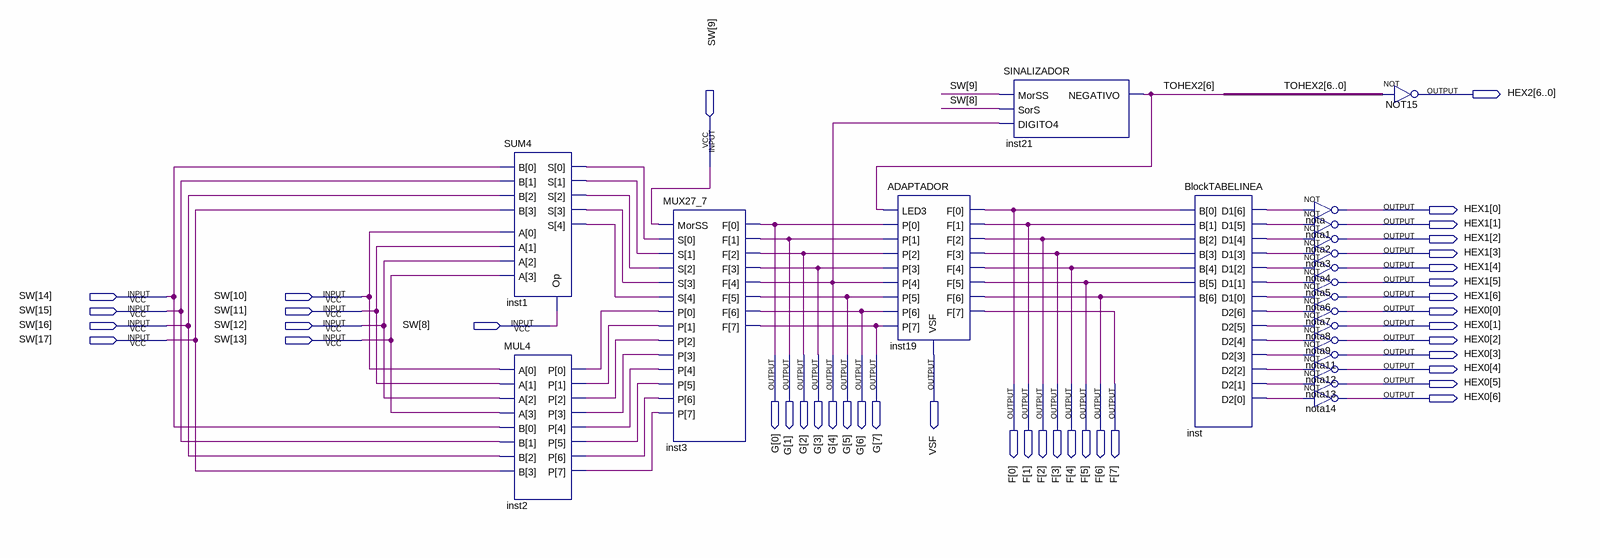
[diagram p0: schematic sheet]
// Quartus schematic ULA.bdf as structural Verilog: 21 symbols, 42 pins
module ULA (
  input  [17:8] SW,
  output [6:0] HEX2,
  output [6:0] HEX1,
  output [6:0] HEX0,
  output [7:0] G,
  output VSF,
  output [7:0] F
);

  wire inst1_s, inst1_s_2, inst1_s_3, inst1_s_4, inst1_s_5, inst2_p, inst2_p_2, inst2_p_3, inst2_p_4,
       inst2_p_5, inst2_p_6, inst2_p_7, inst2_p_8, inst_d1, inst_d1_2, inst_d1_3, inst_d1_4, inst_d1_5,
       inst_d1_6, inst_d1_7, inst_d2, inst_d2_2, inst_d2_3, inst_d2_4, inst_d2_5, inst_d2_6, inst_d2_7;
  wire [6:0] TOHEX2;

  SUM4 inst1 (.B(SW[17:14]), .Op(SW[8]), .A(SW[13:10]), .S({inst1_s_5, inst1_s_4, inst1_s_3, inst1_s_2, inst1_s}));
  MUL4 inst2 (
    .A(SW[13:10]), .B(SW[17:14]),
    .P({inst2_p_4, inst2_p_3, inst2_p_2, inst2_p_5, inst2_p_6, inst2_p, inst2_p_7, inst2_p_8}));
  MUX27_7 inst3 (
    .MorSS(SW[9]), .S({inst1_s_5, inst1_s_4, inst1_s_3, inst1_s_2, inst1_s}),
    .P({inst2_p_4, inst2_p_3, inst2_p_2, inst2_p_5, inst2_p_6, inst2_p, inst2_p_7, inst2_p_8}), .F(G));
  ADAPTADOR inst19 (.LED3(TOHEX2[6]), .P(G), .F(F), .VSF(VSF));
  SINALIZADOR inst21 (.MorSS(SW[9]), .SorS(SW[8]), .DIGITO4(G[4]), .NEGATIVO(TOHEX2[6]));
  BlockTABELINEA inst (
    .B(F[6:0]), .D1({inst_d1, inst_d1_2, inst_d1_3, inst_d1_4, inst_d1_5, inst_d1_6, inst_d1_7}),
    .D2({inst_d2, inst_d2_2, inst_d2_3, inst_d2_4, inst_d2_5, inst_d2_6, inst_d2_7}));
  not nota (HEX1[0], inst_d1);
  not nota1 (HEX1[1], inst_d1_2);
  not nota2 (HEX1[2], inst_d1_3);
  not nota3 (HEX1[3], inst_d1_4);
  not nota4 (HEX1[4], inst_d1_5);
  not nota5 (HEX1[5], inst_d1_6);
  not nota6 (HEX1[6], inst_d1_7);
  not nota7 (HEX0[0], inst_d2);
  not nota8 (HEX0[1], inst_d2_2);
  not nota9 (HEX0[2], inst_d2_3);
  not nota11 (HEX0[3], inst_d2_4);
  not nota12 (HEX0[4], inst_d2_5);
  not nota13 (HEX0[5], inst_d2_6);
  not nota14 (HEX0[6], inst_d2_7);
  assign HEX2 = ~TOHEX2;  // NOT NOT15, 7 bits wide
endmodule
